# Altium project PCB_PreDesign.PrjPCB
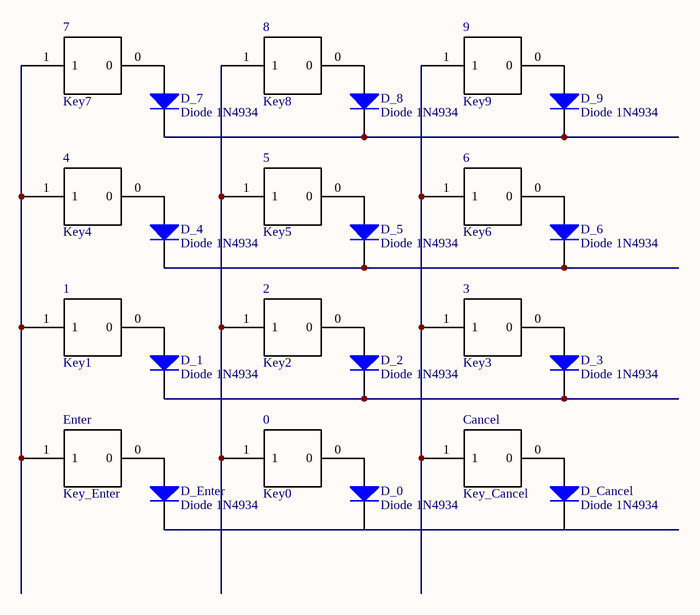
[diagram p0: Num_PreDesign.SchDoc]
1 sheet, 24 parts. Net scope: global (net labels, ports and power ports of the same name join across sheets).
Board file: PCB_PreDesign.PcbDoc

## Sheet Num_PreDesign.SchDoc
size A4

### Parts
0  Key0  [Cherry Standard MX Switch]
1  Key1  [Cherry Standard MX Switch]
2  Key2  [Cherry Standard MX Switch]
3  Key3  [Cherry Standard MX Switch]
4  Key4  [Cherry Standard MX Switch]
5  Key5  [Cherry Standard MX Switch]
6  Key6  [Cherry Standard MX Switch]
7  Key7  [Cherry Standard MX Switch]
8  Key8  [Cherry Standard MX Switch]
9  Key9  [Cherry Standard MX Switch]
Cancel  Key_Cancel  [Cherry Standard MX Switch]
D_0  Diode 1N4934  [DO-41]
D_1  Diode 1N4934  [DO-41]
D_2  Diode 1N4934  [DO-41]
D_3  Diode 1N4934  [DO-41]
D_4  Diode 1N4934  [DO-41]
D_5  Diode 1N4934  [DO-41]
D_6  Diode 1N4934  [DO-41]
D_7  Diode 1N4934  [DO-41]
D_8  Diode 1N4934  [DO-41]
D_9  Diode 1N4934  [DO-41]
D_Cancel  Diode 1N4934  [DO-41]
D_Enter  Diode 1N4934  [DO-41]
Enter  Key_Enter  [Cherry Standard MX Switch]

### Nets
Net0_0: 0.0 D_0.1(A)
Net0_1: 0.1 2.1 5.1 8.1
Net1_0: 1.0 D_1.1(A)
Net1_1: 1.1 4.1 7.1 Enter.1
Net2_0: 2.0 D_2.1(A)
Net3_0: 3.0 D_3.1(A)
Net3_1: 3.1 6.1 9.1 Cancel.1
Net4_0: 4.0 D_4.1(A)
Net5_0: 5.0 D_5.1(A)
Net6_0: 6.0 D_6.1(A)
Net7_0: 7.0 D_7.1(A)
Net8_0: 8.0 D_8.1(A)
Net9_0: 9.0 D_9.1(A)
NetCancel_0: Cancel.0 D_Cancel.1(A)
NetD_0_2: D_0.2(K) D_Cancel.2(K) D_Enter.2(K)
NetD_1_2: D_1.2(K) D_2.2(K) D_3.2(K)
NetD_4_2: D_4.2(K) D_5.2(K) D_6.2(K)
NetD_7_2: D_7.2(K) D_8.2(K) D_9.2(K)
NetD_Enter_1: D_Enter.1(A) Enter.0

### Library data of the parts
0-9 Cancel Enter = Cherry MX
D_0-D_9 D_Cancel D_Enter = Diode 1N4934: 1 Amp Fast Recovery Rectifier; Published: 8-Jun-2000; LatestRevisionDate: 17-Jul-2002; LatestRevisionNote: Re-released for DXP Platform.; DatasheetVersion: 1999; PackageVersion: Aug-1999; PackageReference: DO-41; Publisher: Altium Limited; PackageDescription: Diode, Axial; Body 5.2 x 2.7 mm (LxDia. max), Lead Dia. 0.86 mm (max); Code_JEDEC: DO-204-AL; ComponentLink1Description: Manufacturer Link; ComponentLink1URL: http://www.fairchildsemi.com/; ComponentLink2Description: Datasheet; ComponentLink2URL: http://www.fairchildsemi.com/ds/1N%2F1N4934.pdf